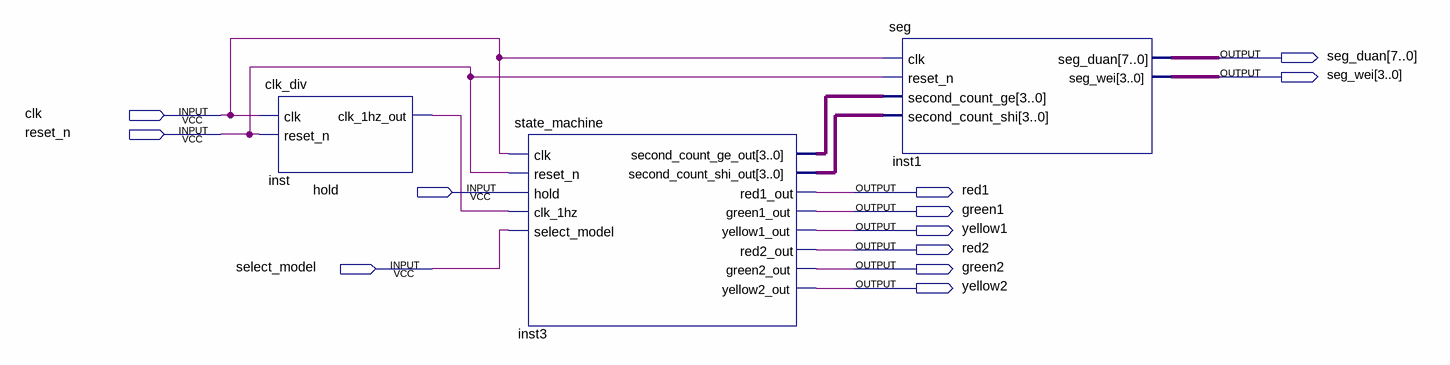
[diagram p0: schematic sheet]
// Quartus schematic trafficlight.bdf as structural Verilog: 3 symbols, 12 pins
module trafficlight (
  input  clk,
  input  reset_n,
  input  hold,
  input  select_model,
  output [7:0] seg_duan,
  output [3:0] seg_wei,
  output red1,
  output green1,
  output yellow1,
  output red2,
  output green2,
  output yellow2
);

  wire inst_clk_1hz_out;
  wire [3:0] inst3_second_count_ge_out, inst3_second_count_shi_out;

  clk_div inst (.clk(clk), .reset_n(reset_n), .clk_1hz_out(inst_clk_1hz_out));
  state_machine inst3 (
    .clk(clk), .reset_n(reset_n), .hold(hold), .clk_1hz(inst_clk_1hz_out), .select_model(select_model),
    .second_count_ge_out(inst3_second_count_ge_out), .second_count_shi_out(inst3_second_count_shi_out),
    .red1_out(red1), .green1_out(green1), .yellow1_out(yellow1), .red2_out(red2), .green2_out(green2),
    .yellow2_out(yellow2));
  seg inst1 (
    .clk(clk), .reset_n(reset_n), .second_count_ge(inst3_second_count_ge_out),
    .second_count_shi(inst3_second_count_shi_out), .seg_duan(seg_duan), .seg_wei(seg_wei));
endmodule
